# EAGLE design stereo-jack (EAGLE 6.5.0)
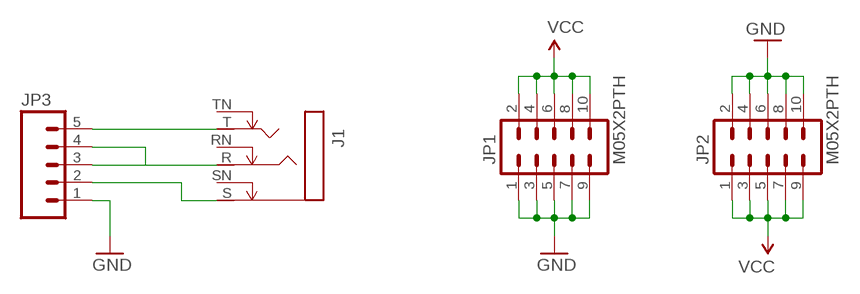
[diagram p0: schematic, sheet 1]

## Parts
J1  STEREOSW  [NMJ6HCD2]
JP1  M05X2PTH  [AVR_ICSP]
JP2  M05X2PTH  [AVR_ICSP]
JP3  M05PTH  [1X05]

## Nets
GND: JP1.1 JP1.3 JP1.5 JP1.7 JP1.9 JP2.2 JP2.4 JP2.6 JP2.8 JP2.10 JP3.1
N$1: J1.S JP3.2
N$2: J1.R JP3.3 JP3.4
N$3: J1.T JP3.5
VCC: JP1.2 JP1.4 JP1.6 JP1.8 JP1.10 JP2.1 JP2.3 JP2.5 JP2.7 JP2.9
Unconnected: J1.RN J1.SN J1.TN

## Library data of the parts
J1 = gm-jacks:STEREOSW
JP1 JP2 = SparkFun:M05X2: Header 5x2 Standard 10-pin dual row 0.1" header. Commonly used with AVR-ISP. Use with Spark Fun Electronics SKU: PRT-00778
JP3 = SparkFun:M05: Header 5 Standard 5-pin 0.1" header. Use with straight break away headers (SKU : PRT-00116), right angle break away headers (PRT-00553), swiss pins (PRT-00743), machine pins (PRT-00117), and female headers (PRT-00115). Molex polarized connector foot print use with SKU : PRT-08230 with associated crimp pins and housings.

## Board
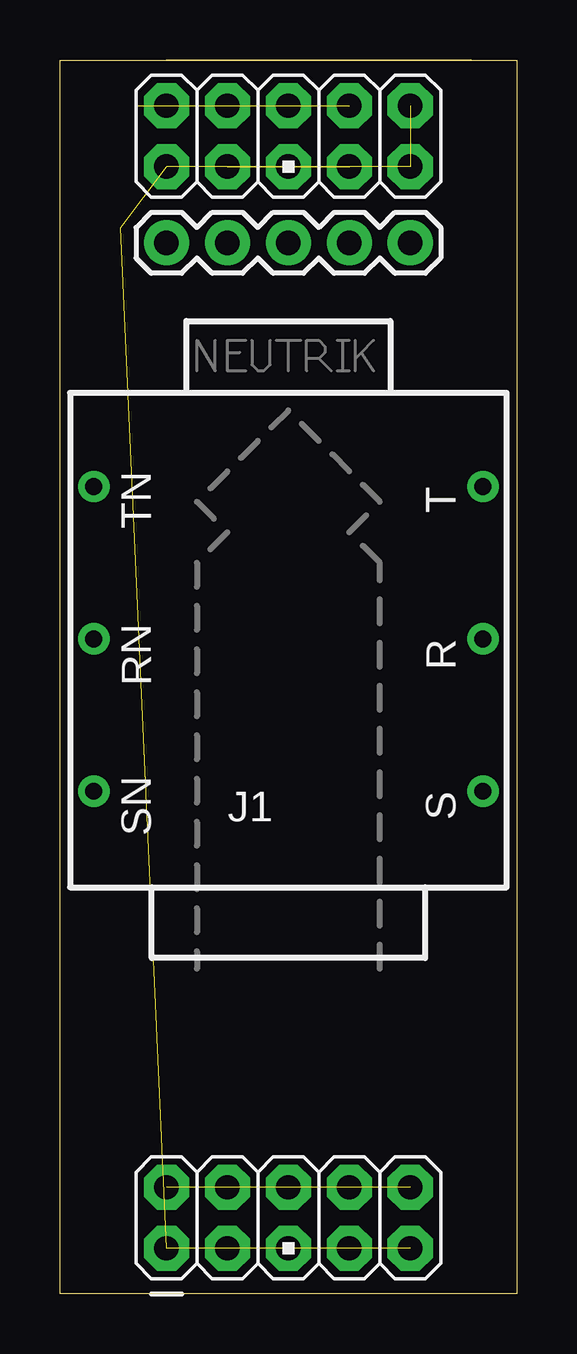
[diagram p1: board, top side]
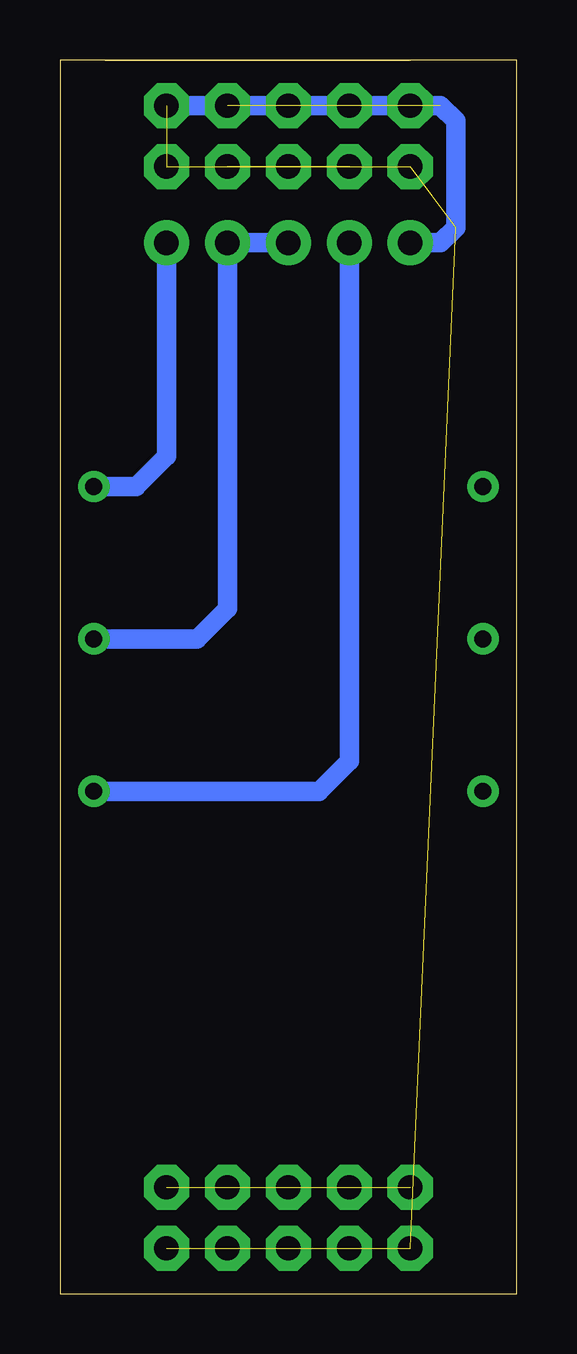
[diagram p2: board, bottom side, seen from below]

Size 19.05 x 51.43 mm. Coordinates in mm from the lower left corner, seen from the top.
Outline: 17.16,51.42 4.44,51.42
Outline: 0,51.43 19.05,51.43 19.05,0 17.15,0 3.18,0 0,0 0,51.43
Copper layers (1*16): Top 0.035mm / dielectric 1.5mm / Bottom 0.035mm
Design rules "SparkFun_10mil *": minimum track width 8mil, minimum drill 20mil, track to track 8mil, track to pad 8mil, pad to pad 8mil, via to via 8mil, smd to smd 8mil, copper to edge 8mil, drill to drill 8mil, minimum pad ring 12mil, minimum via ring 10mil, stop-mask expansion 4mil, vias tented up to drill 25mil, thermal gap 10mil

### Footprints (pad centres in the part's own frame; a part is rotated, then mirrored left to right if it is on the bottom)
NMJ6HCD2 = drill 0.7: R 0,8.115; RN 0,-8.115; S 6.35,8.115; SN 6.35,-8.115; T -6.35,8.115; TN -6.35,-8.115
AVR_ICSP = drill 1.016 pad 1.88 octagon: 1 -1.27,5.08; 2 1.27,5.08; 3 -1.27,2.54; 4 1.27,2.54; 5 -1.27,0; 6 1.27,0; 7 -1.27,-2.54; 8 1.27,-2.54; 9 -1.27,-5.08; 10 1.27,-5.08
1X05 = drill 1.016 pad 1.88: 1 0,0; 2 2.54,0; 3 5.08,0; 4 7.62,0; 5 10.16,0

### Placement (x,y rotation side)
J1  9.52,27.3 270 top
JP1  9.52,48.26 90 top
JP2  9.52,3.18 90 top
JP3  4.45,43.81 0 top

### Tracks (layer width: path | path; a pad name or v marks a point on that pad's centre or on a via)
GND  (10 unrouted)
  Bottom 0.406: 2.54,44.45 2.54,48.89 3.18,49.53 14.61,49.53
  Bottom 0.813: JP3.1 3.18,43.81 2.54,44.45
N$1
  Bottom 0.813: JP3.2 6.98,22.23 8.25,20.96 J1.S
N$2
  Bottom 0.813: JP3.3 JP3.4 12.06,28.57 13.34,27.3 J1.R
N$3
  Bottom 0.813: J1.T 15.88,33.65 14.61,34.92 JP3.5
VCC  (9 unrouted)
  Bottom 0.813: JP1.10 3.18,49.53 2.54,48.89 2.54,44.45